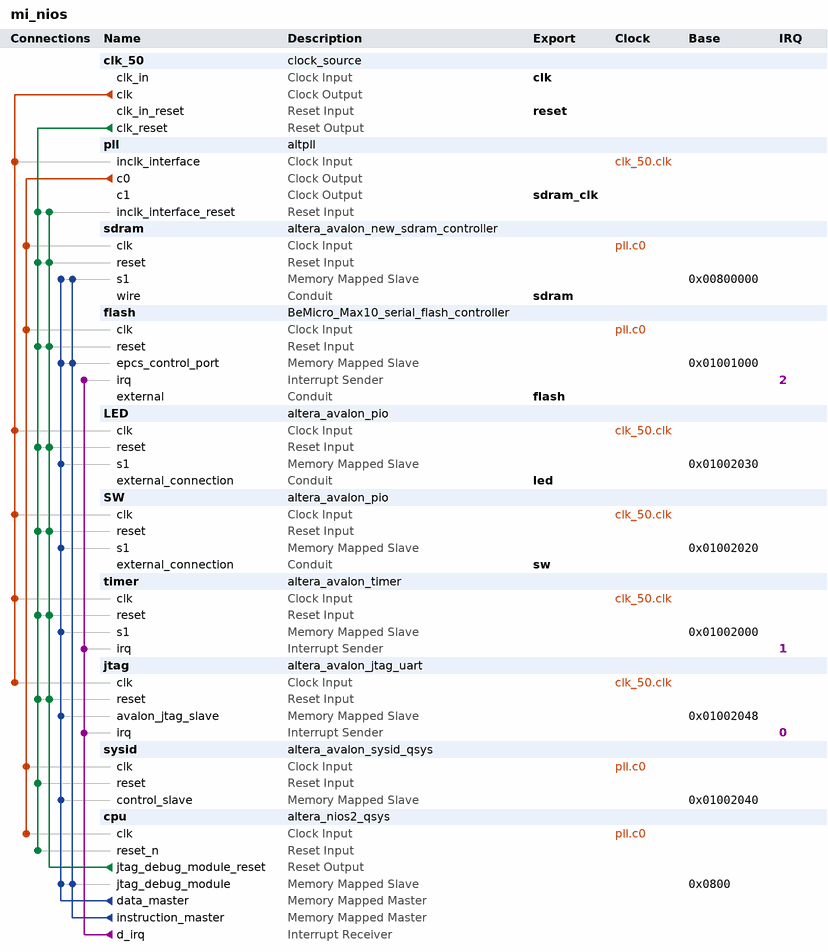
[diagram p0: system contents]
# Platform Designer (Qsys) system mi_nios, MAX 10 10M08DAF484C8GES
# Parameters at their usual value, and those the tool derives, are not listed.
package require -exact qsys 14.1
create_system mi_nios
set_project_property DEVICE_FAMILY {MAX 10}
set_project_property DEVICE 10M08DAF484C8GES

add_instance clk_50 clock_source 14.1
set_instance_parameter_value clk_50 clockFrequency 50000000

add_instance pll altpll 14.1
set_instance_parameter_value pll CLK0_DIVIDE_BY 5
set_instance_parameter_value pll CLK0_MULTIPLY_BY 8
set_instance_parameter_value pll CLK1_DIVIDE_BY 5
set_instance_parameter_value pll CLK1_DUTY_CYCLE 50
set_instance_parameter_value pll CLK1_MULTIPLY_BY 8
set_instance_parameter_value pll CLK1_PHASE_SHIFT -3125
set_instance_parameter_value pll INCLK0_INPUT_FREQUENCY 20000
set_instance_parameter_value pll PORT_ARESET PORT_UNUSED
set_instance_parameter_value pll PORT_LOCKED PORT_UNUSED
set_instance_parameter_value pll PORT_clk1 PORT_USED
set_instance_parameter_value pll PORT_clk2 PORT_UNUSED
set_instance_parameter_value pll PORT_clk3 PORT_UNUSED

add_instance sdram altera_avalon_new_sdram_controller 14.1
set_instance_parameter_value sdram TAC 5.4
set_instance_parameter_value sdram TRCD 15.0
set_instance_parameter_value sdram TRP 15.0
set_instance_parameter_value sdram casLatency 2
set_instance_parameter_value sdram columnWidth 8
set_instance_parameter_value sdram dataWidth 16
set_instance_parameter_value sdram generateSimulationModel false
set_instance_parameter_value sdram model single_Micron_MT48LC4M32B2_7_chip
set_instance_parameter_value sdram numberOfBanks 4
set_instance_parameter_value sdram numberOfChipSelects 1
set_instance_parameter_value sdram powerUpDelay 100.0
set_instance_parameter_value sdram refreshPeriod 15.625
set_instance_parameter_value sdram rowWidth 12

add_instance flash BeMicro_Max10_serial_flash_controller 14.0
set_instance_parameter_value flash autoSelectASMIAtom false
set_instance_parameter_value flash resetrequest_enabled true
set_instance_parameter_value flash useASMIAtom false

add_instance LED altera_avalon_pio 14.1
set_instance_parameter_value LED direction Output
set_instance_parameter_value LED width 8

add_instance SW altera_avalon_pio 14.1
set_instance_parameter_value SW direction Input
set_instance_parameter_value SW width 4

add_instance timer altera_avalon_timer 14.1
set_instance_parameter_value timer period 1
set_instance_parameter_value timer periodUnits MSEC

add_instance jtag altera_avalon_jtag_uart 14.1
set_instance_parameter_value jtag simInteractiveOptions NO_INTERACTIVE_WINDOWS

add_instance sysid altera_avalon_sysid_qsys 14.1
set_instance_parameter_value sysid id 0

add_instance cpu altera_nios2_qsys 14.1
set_instance_parameter_value cpu breakSlave cpu.jtag_debug_module
set_instance_parameter_value cpu exceptionSlave sdram.s1
set_instance_parameter_value cpu icache_size 4096
set_instance_parameter_value cpu impl Tiny
set_instance_parameter_value cpu mmu_TLBMissExcSlave None
set_instance_parameter_value cpu muldiv_multiplierType DSPBlock
set_instance_parameter_value cpu resetSlave flash.epcs_control_port
set_instance_parameter_value cpu resetrequest_enabled true

# connections
add_connection clk_50.clk jtag.clk clock
add_connection clk_50.clk LED.clk clock
add_connection clk_50.clk pll.inclk_interface clock
add_connection clk_50.clk SW.clk clock
add_connection clk_50.clk timer.clk clock
add_connection pll.c0 cpu.clk clock
add_connection pll.c0 flash.clk clock
add_connection pll.c0 sdram.clk clock
add_connection pll.c0 sysid.clk clock
add_connection clk_50.clk_reset cpu.reset_n reset
add_connection clk_50.clk_reset flash.reset reset
add_connection clk_50.clk_reset jtag.reset reset
add_connection clk_50.clk_reset LED.reset reset
add_connection clk_50.clk_reset pll.inclk_interface_reset reset
add_connection clk_50.clk_reset sdram.reset reset
add_connection clk_50.clk_reset SW.reset reset
add_connection clk_50.clk_reset sysid.reset reset
add_connection clk_50.clk_reset timer.reset reset
add_connection cpu.jtag_debug_module_reset flash.reset reset
add_connection cpu.jtag_debug_module_reset jtag.reset reset
add_connection cpu.jtag_debug_module_reset LED.reset reset
add_connection cpu.jtag_debug_module_reset pll.inclk_interface_reset reset
add_connection cpu.jtag_debug_module_reset sdram.reset reset
add_connection cpu.jtag_debug_module_reset SW.reset reset
add_connection cpu.jtag_debug_module_reset timer.reset reset
add_connection cpu.data_master cpu.jtag_debug_module avalon
set_connection_parameter_value cpu.data_master/cpu.jtag_debug_module baseAddress 0x0800
add_connection cpu.data_master flash.epcs_control_port avalon
set_connection_parameter_value cpu.data_master/flash.epcs_control_port baseAddress 0x01001000
add_connection cpu.data_master jtag.avalon_jtag_slave avalon
set_connection_parameter_value cpu.data_master/jtag.avalon_jtag_slave baseAddress 0x01002048
add_connection cpu.data_master LED.s1 avalon
set_connection_parameter_value cpu.data_master/LED.s1 baseAddress 0x01002030
add_connection cpu.data_master sdram.s1 avalon
set_connection_parameter_value cpu.data_master/sdram.s1 baseAddress 0x00800000
add_connection cpu.data_master SW.s1 avalon
set_connection_parameter_value cpu.data_master/SW.s1 baseAddress 0x01002020
add_connection cpu.data_master sysid.control_slave avalon
set_connection_parameter_value cpu.data_master/sysid.control_slave baseAddress 0x01002040
add_connection cpu.data_master timer.s1 avalon
set_connection_parameter_value cpu.data_master/timer.s1 baseAddress 0x01002000
add_connection cpu.instruction_master cpu.jtag_debug_module avalon
set_connection_parameter_value cpu.instruction_master/cpu.jtag_debug_module baseAddress 0x0800
add_connection cpu.instruction_master flash.epcs_control_port avalon
set_connection_parameter_value cpu.instruction_master/flash.epcs_control_port baseAddress 0x01001000
add_connection cpu.instruction_master sdram.s1 avalon
set_connection_parameter_value cpu.instruction_master/sdram.s1 baseAddress 0x00800000
add_connection cpu.d_irq flash.irq interrupt
set_connection_parameter_value cpu.d_irq/flash.irq irqNumber 2
add_connection cpu.d_irq jtag.irq interrupt
set_connection_parameter_value cpu.d_irq/jtag.irq irqNumber 0
add_connection cpu.d_irq timer.irq interrupt
set_connection_parameter_value cpu.d_irq/timer.irq irqNumber 1

# exported interfaces
add_interface clk clock sink
set_interface_property clk EXPORT_OF clk_50.clk_in
add_interface flash conduit end
set_interface_property flash EXPORT_OF flash.external
add_interface led conduit end
set_interface_property led EXPORT_OF LED.external_connection
add_interface reset reset sink
set_interface_property reset EXPORT_OF clk_50.clk_in_reset
add_interface sdram conduit end
set_interface_property sdram EXPORT_OF sdram.wire
add_interface sdram_clk clock source
set_interface_property sdram_clk EXPORT_OF pll.c1
add_interface sw conduit end
set_interface_property sw EXPORT_OF SW.external_connection

set_interconnect_requirement {$system} qsys_mm.clockCrossingAdapter HANDSHAKE
set_interconnect_requirement {$system} qsys_mm.insertDefaultSlave FALSE
set_interconnect_requirement {$system} qsys_mm.maxAdditionalLatency 1

save_system mi_nios.qsys
